# Altium schematic sheet Battery Charger.SchDoc
size A4; SheetNumber: 6; SheetTotal: 6
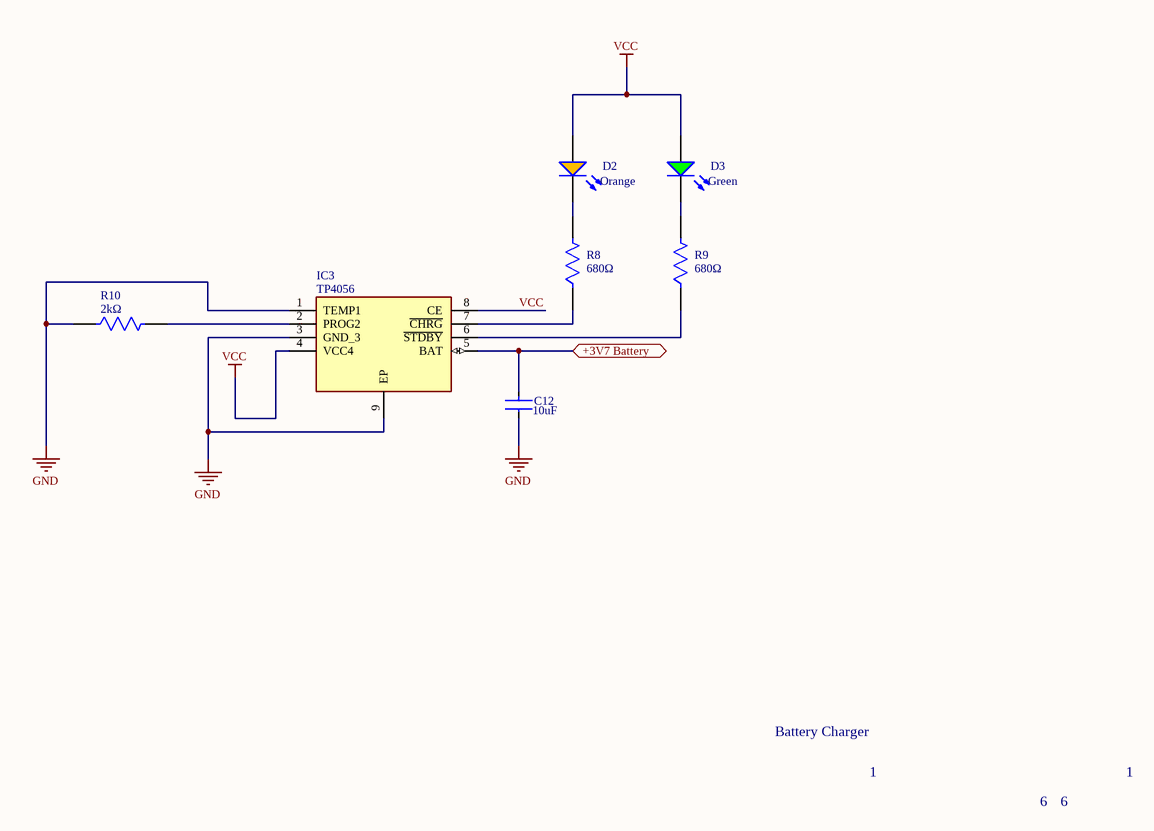
[diagram p0: Battery Charger.SchDoc]

## Parts
C12  value 10uF  [FP-GCM21B-0_2-e0_2_0_7-MFG]  (hidden comment: GCM21BC71E106KE36L)
D2  Color: Orange  [WL-SMCW_1206_150120xx75000]  (hidden comment: 150120AS75000)
D3  Color: Green  [WL-SMCW_1206_150120xx75000]  (hidden comment: 150120GS75000)
IC3  TP4056  [SOIC127P600X175-9N]
R8  value 680Ω  [FP-MCU0805-MFG]  (hidden comment: MCU08050D6800BP500)
R9  value 680Ω  [FP-MCU0805-MFG]  (hidden comment: MCU08050D6800BP500)
R10  value 2kΩ  [FP-RC2012-MFG]  (hidden comment: RC2012F202CS)

## Ports
+3V7 Battery (bidir, see Encode Schematic[1C], Battery Protection[3C], Voltage Regulator[2B])

## Nets
GND: C12.2 IC3.1(TEMP1) IC3.3(GND_3) IC3.9(EP) R10.1
VCC: D2.2(A) D3.2(A) IC3.4(VCC4) IC3.8(CE)
+3V7 Battery: C12.1 IC3.5(BAT) ; port +3V7 Battery
NetD2_1: D2.1(K) R8.2
NetD3_1: D3.1(K) R9.2
NetIC3_2: IC3.2(PROG2) R10.2
NetIC3_6: IC3.6(~{STDBY}) R9.1
NetIC3_7: IC3.7(~{CHRG}) R8.1

## Notes on the sheet
- Battery Charger
- 1
- 6

## Library data of the parts
C12 = CMP-06035-063206-1: 10 µF ±10% 25V Ceramic Capacitor X7S 0805 (2012 Metric)
D2 = CMP-1426-00018-2: NexarPartId: 29717785; Test Current: 20mA; Forward Voltage: 2V; Peak Wavelength: 610nm; Luminous Intensity: 140mcd; Dominant Wavelength: 605nm; Lens Style: Clear, Rectangular; Forward Current: 100mA; Max Reverse Voltage (DC): 5V; Viewing Angle: 140°; RoHS: Compliant; Mount: Surface Mount; Case/Package: 1206; REACH SVHC: Unknown; Packaging: Tape and Reel; Min Operating Temperature: -40°C; Length: 3.2mm; Max Operating Temperature: 85°C; Case Code (Metric): 3216; Width: 1.6mm; Case Code (Imperial): 1206; Wavelength: 605nm; Height: 680µm
D3 = CMP-1426-00014-3: NexarPartId: 29717787; Peak Wavelength: 515nm; Wavelength: 520nm; Test Current: 20mA; Dominant Wavelength: 525nm; Luminous Intensity: 450mcd; Max Junction Temperature (Tj): 95°C; Power Dissipation: 105mW; Reverse Voltage: 5V; Forward Current: 100mA; Viewing Angle: 140°; Forward Voltage: 3.2V; Lens Style: Clear, Rectangular; Width: 1.6mm; Case Code (Metric): 3216; Mount: Surface Mount; Min Operating Temperature: -40°C; Packaging: Tape and Reel; Length: 3.2mm; REACH SVHC: Unknown; Max Reverse Voltage (DC): 5V; Case/Package: 1206; Height: 680µm; Case Code (Imperial): 1206; RoHS: Compliant; Max Operating Temperature: 85°C
IC3 = TP4056: Connector; Manufacturer_Name: NanJing Top Power; Datasheet Link: https://dlnmh9ip6v2uc.cloudfront.net/datasheets/Prototyping/TP4056.pdf; Height: 1.75mm; Manufacturer_Part_Number: TP4056
R8 R9 = CMP-02407-000244-1: RES 1.05K OHM 0.5% 1/5W 0805; Temperature Coefficient: 25ppm/°C; Resistance: 680R; Tolerance: 0.1%; Max Power Dissipation: 125mW; Contact Plating: Tin; Depth: 1.25mm; Height: 0.022inch; Number of Terminations: 2; Max Operating Temperature: 125°C; Case/Package: 0805; Military Standard: Not; Packaging: Tape and Reel; Width: 0.049inch; Min Operating Temperature: -55°C; Lead Free: Lead Free; Composition: Thin Film; Length: 0.079inch; Package Quantity: 5000; Radiation Hardening: No
R10 = CMP-13261-004148-1: Res Thick Film 0805 2kΩ 1% 0.125W ±100ppm/°C Molded SMD T/R; Voltage Rating (DC): 150V; Max Power Dissipation: 125mW; Resistance: 2kR; Case/Package: 0805; Height: 0.024inch; Number of Terminations: 2; Packaging: Tape and Reel; Length: 0.079inch; Contact Plating: Tin; Temperature Coefficient: 100ppm/°C; Width: 0.049inch; Composition: Thick Film; Case Code (Imperial): 0805; Min Operating Temperature: -55°C; Case Code (Metric): 2012; Features: Moisture Resistant; Tolerance: 1%; Radiation Hardening: No; Lead Free: Lead Free; Max Operating Temperature: 155°C